# EAGLE design CC2500 Module (EAGLE 6.1)
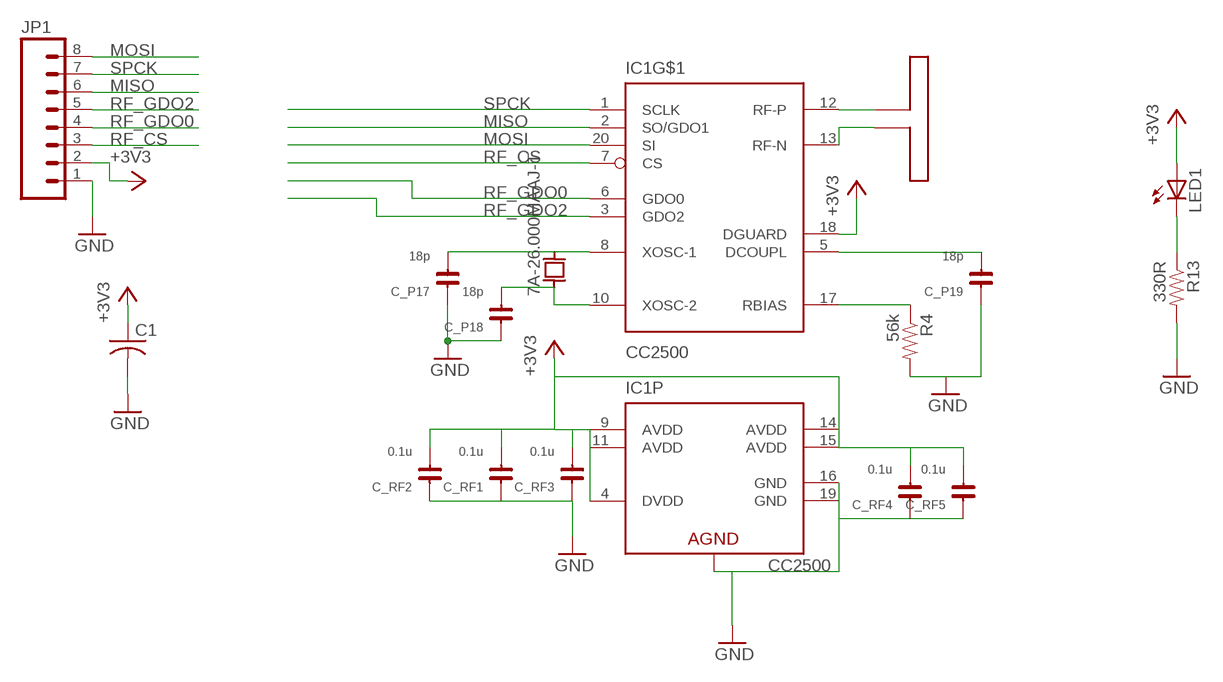
[diagram p0: schematic, sheet 1]

## Parts
C1  C-USC1206  [C1206]
C_P17  18p  CAPACITOR0603-CAP  [0603-CAP]
C_P18  18p  CAPACITOR0603-CAP  [0603-CAP]
C_P19  18p  CAPACITOR0603-CAP  [0603-CAP]
C_RF1  0.1u  CAPACITOR0603-CAP  [0603-CAP]
C_RF2  0.1u  CAPACITOR0603-CAP  [0603-CAP]
C_RF3  0.1u  CAPACITOR0603-CAP  [0603-CAP]
C_RF4  0.1u  CAPACITOR0603-CAP  [0603-CAP]
C_RF5  0.1u  CAPACITOR0603-CAP  [0603-CAP]
IC1  CC2500  [QLP-20]
JP1  M081X08  [1X08]
LED1  LED1206  [LED-1206]
R4  56k  RESISTOR0402-RES  [0402-RES]
R13  330R  RESISTOR0402-RES  [0402-RES]
U$22  ANTENNA_DIPOLE  [CC2500_FOLDED_DIPOLE_ANTENNA]
U$23  7A-26.000MAAJ-T  XTAL_2_PIN5MMX3.2MM  [5X3.2MM_SMD_XTAL]

## Nets
+3V3 [Power]: C1.1 C_RF1.2 C_RF2.2 C_RF3.2 C_RF4.2 C_RF5.2 IC1.4(P:DVDD) IC1.9(P:AVDD) IC1.11(P:AVDD) IC1.14(P:AVDD) IC1.15(P:AVDD) IC1.18(DGUARD) JP1.2 LED1.A
DCOUPL: C_P19.2 IC1.5(DCOUPL)
GND [Power]: C1.2 C_P17.1 C_P18.1 C_P19.1 C_RF1.1 C_RF2.1 C_RF3.1 C_RF4.1 C_RF5.1 IC1.16(P:GND) IC1.19(P:GND) IC1.PAD(P:AGND) IC1.THERMAL1(P:AGND) IC1.THERMAL2(P:AGND) IC1.THERMAL3(P:AGND) IC1.THERMAL4(P:AGND) IC1.THERMAL5(P:AGND) JP1.1 R4.2 R13.2
MISO: IC1.2(SO/GDO1) JP1.6
MOSI: IC1.20(SI) JP1.8
N$6: LED1.C R13.1
N$8: IC1.12(RF-P) U$22.P$1
N$13: IC1.13(RF-N) U$22.P$2
N$15: C_P17.2 IC1.8(XOSC-1) U$23.X2
N$20: C_P18.2 IC1.10(XOSC-2) U$23.X1
N$23: IC1.17(RBIAS) R4.1
RF_CS: IC1.7(CS) JP1.3
RF_GDO0: IC1.6(GDO0) JP1.4
RF_GDO2: IC1.3(GDO2) JP1.5
SPCK: IC1.1(SCLK) JP1.7

## Library data of the parts
C1 = rcl:C-US: CAPACITOR, American symbol
C_P17-C_P19 C_RF1-C_RF5 = taylor:CAPACITOR
IC1 = chipcon-ti:CC2500: Single Chip Low Cost Low Power RF Transceiver frequency band at 2400MHz-2483.5MHz.
JP1 = SparkFun:M08: Header 8 Standard 8-pin 0.1" header. Use with straight break away headers (SKU : PRT-00116), right angle break away headers (PRT-00553), swiss pins (PRT-00743), machine pins (PRT-00117), and female headers (PRT-00115).
LED1 = SparkFun:LED: LEDs Standard schematic elements and footprints for 5mm, 3mm, 1206, and 0603 sized LEDs. 5mm - Spark Fun Electronics SKU : COM-00529 (and others)
R4 R13 = SparkFun:RESISTOR: Resistor Basic schematic elements and footprints for 0603, 1206, and PTH resistors.
U$22 = taylor:ANTENNA_DIPOLE
U$23 = taylor:XTAL_2_PIN: 5mm x 3.2mm smd crystal 16MHz and other 8pF load caps 644-1037-1-ND NX5032GA-16.000000MHZ 6mmx3.5mm 18.432MHz and 20MHz crystals 20pF load XC826CT-ND XC830CT-ND ABS06 RTC 535-10104-1-ND 18pf

## Net classes
0 default: width 0.254 mm, drill 0.508 mm, clearance 0.254 mm
1 Power: width 0.762 mm, drill 0.889 mm, clearance 0.203 mm

## Board
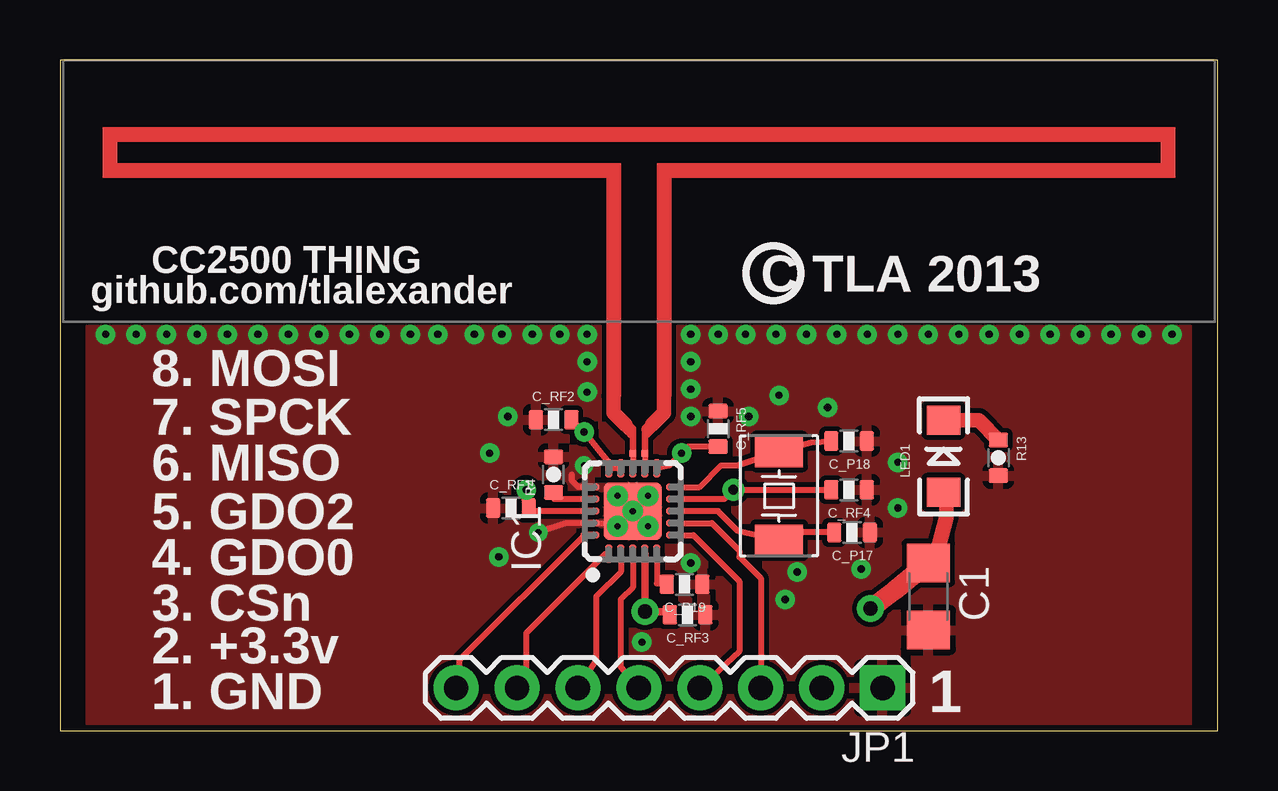
[diagram p1: board, top side]
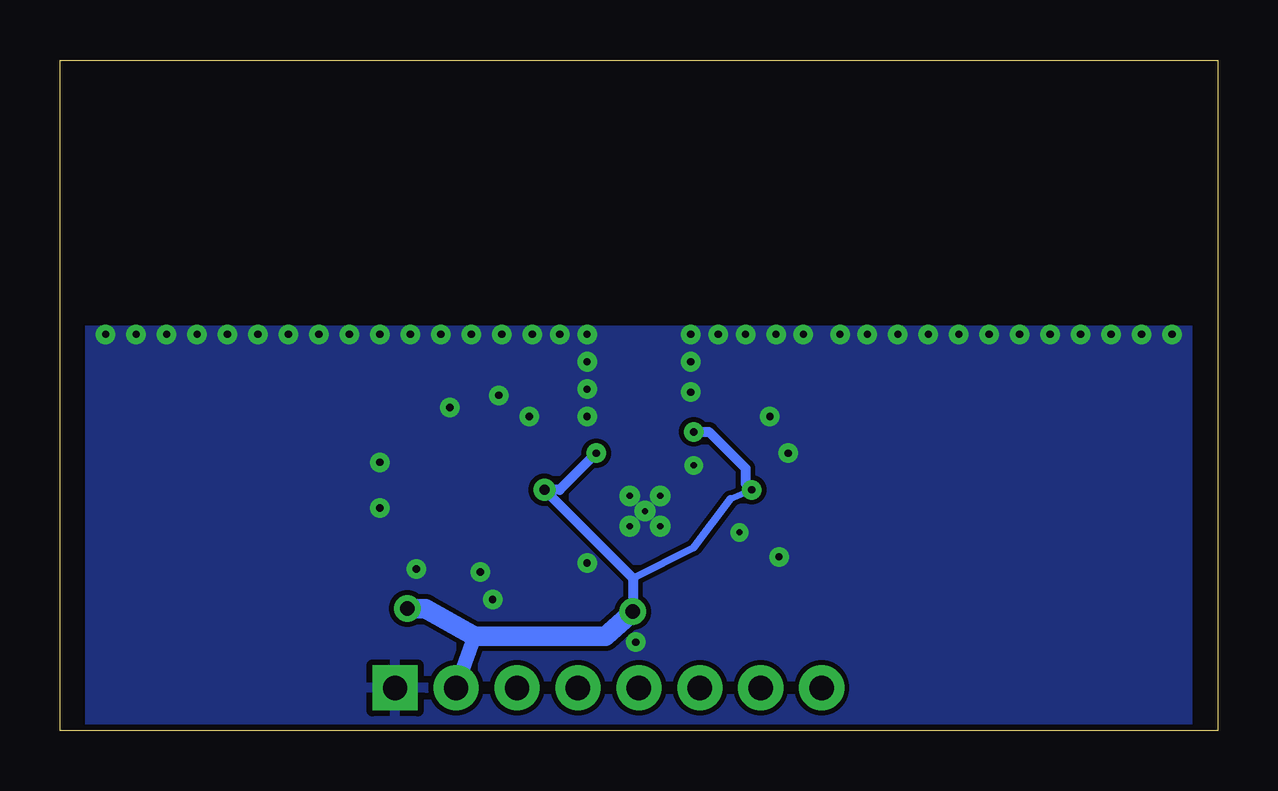
[diagram p2: board, bottom side, seen from below]

Size 48.26 x 27.94 mm. Coordinates in mm from the lower left corner, seen from the top.
Outline: 0,0 48.26,0 48.26,27.94 0,27.94 0,0
Copper layers (1*16): Top 0.035mm / dielectric 1.5mm / Bottom 0.035mm
Design rules "default": minimum track width 8mil, minimum drill 20mil, track to track 8mil, track to pad 8mil, pad to pad 8mil, via to via 8mil, smd to smd 8mil, copper to edge 10mil, drill to drill 8mil, minimum pad ring 12mil, minimum via ring 10mil, stop-mask expansion 4mil, vias tented up to drill 25mil, thermal gap 10mil
tRestrict: area 0,17 to 48.3,27.9
bRestrict: area 0,17 to 48.3,27.9

### Footprints (pad centres in the part's own frame; a part is rotated, then mirrored left to right if it is on the bottom)
C1206 = smd 1.6 x 1.8: 1 -1.4,0; 2 1.4,0
0603-CAP = smd 0.6 x 0.8: 1 -0.74,0; 2 0.74,0
QLP-20 = smd 0.76 x 0.28: 1 -1.78,1; 2 -1.78,0.5; 3 -1.78,0; 4 -1.78,-0.5; 5 -1.78,-1; 11 1.78,-1; 12 1.78,-0.5; 13 1.78,0; 14 1.78,0.5; 15 1.78,1 | smd 0.28 x 0.76: 6 -1,-1.78; 7 -0.5,-1.78; 8 0,-1.78; 9 0.5,-1.78; 10 1,-1.78; 16 1,1.78; 17 0.5,1.78; 18 0,1.78; 19 -0.5,1.78; 20 -1,1.78 | smd 2.4 x 2.4: PAD 0,0 | drill 0.254: THERMAL1 0,0; THERMAL2 -0.635,0.635; THERMAL3 0.635,0.635; THERMAL4 0.635,-0.635; THERMAL5 -0.635,-0.635
1X08 = drill 1.016 pad 1.88 square: 1 0,0 | drill 1.016 pad 1.88: 2 2.54,0; 3 5.08,0; 4 7.62,0; 5 10.16,0; 6 12.7,0; 7 15.24,0; 8 17.78,0
LED-1206 = smd 1.2 x 1.4: A -1.5,0; C 1.5,0
0402-RES = smd 0.6 x 0.8: 1 -0.74,0; 2 0.74,0
CC2500_FOLDED_DIPOLE_ANTENNA = smd 0.28 x 0.28: P$1 0.25,-16.4; P$2 -0.25,-16.4
5X3.2MM_SMD_XTAL = smd 1.3 x 2: X1 -1.85,0; X2 1.85,0

### Placement (x,y rotation side)
C1  36.2,5.59 270 top
C_P17  33.02,8.26 180 top
C_P18  32.89,12.06 180 top
C_P19  26.04,6.1 180 top
C_RF1  18.8,9.27 0 top
C_RF2  20.57,12.95 0 top
C_RF3  26.16,4.83 180 top
C_RF4  32.89,10.03 180 top
C_RF5  27.43,12.57 270 top
IC1  23.88,9.14 90 top
JP1  34.29,1.78 180 top
LED1  36.83,11.43 90 top
R4  20.57,10.67 90 top
R13  39.12,11.37 270 top
U$22  24.13,27.94 0 top
U$23  29.97,9.78 270 top

### Tracks (layer width: path | path; a pad name or v marks a point on that pad's centre or on a via)
+3V3  (via drill 0.3, 0.41, 0.6)
  Top 0.254: IC1.14 IC1.15 22.88,11.16 v21.84,12.45 21.84,12.42 C_RF2.2 | IC1.11 25.39,11.04 v25.91,11.56 26.18,11.83 C_RF5.2 | IC1.9 27.68,9.64 v28.07,10.03 C_RF4.2 | v19.43,10.03 C_RF1.2 19.66,9.14 IC1.18
  Top 0.305: IC1.4 v24.38,4.95 25.3,4.95 C_RF3.2
  Top 0.61: C1.1 36.45,6.99 36.96,8.89 36.96,9.93 LED1.A
  Top 0.813: C1.1 34.8,5.84 v33.78,5.08
  Bottom 0.254: 20.32,9.65 v19.43,10.03
  Bottom 0.305: 20.32,9.65 21.84,7.62 24.38,6.35
  Bottom 0.406: v24.38,4.95 24.38,6.35 v28.07,10.03 27.43,10.03 v25.91,11.56 | v21.84,12.45 21.21,12.45 19.68,10.92 19.68,10.29 v19.43,10.03
  Bottom 0.61: JP1.2 30.99,3.94
  Bottom 0.813: v24.38,4.95 25.53,3.94 30.99,3.94 33.02,5.08 v33.78,5.08
DCOUPL
  Top 0.254: IC1.5 24.88,6.13 C_P19.2
GND  (via drill 0.25, 0.3)
  Top 0.254: 21.59,10.16 21.61,10.14 IC1.16 21.96,10.16 21.59,10.16 | 21.59,10.16 21.34,10.41 21.34,10.67 | v19.94,8.26 21.09,8.64 IC1.19 23.24,8.64 IC1.THERMAL2
  other vias: 17.91,11.56 20.83,16.51 27.43,16.51 31.11,16.51 29.84,16.51 28.57,16.51 19.68,16.51 18.41,16.51 17.27,16.51 15.75,16.51 14.61,16.51 13.34,16.51 12.06,16.51 10.79,16.51 9.53,16.51 8.26,16.51 32.38,16.51 33.66,16.51 34.92,16.51 36.2,16.51 37.47,16.51 38.73,16.51 40.01,16.51 41.27,16.51 42.55,16.51 43.81,16.51 45.09,16.51 46.35,16.51 6.99,16.51 4.45,16.51 3.17,16.51 1.91,16.51 26.29,16.51 30.23,5.46 30.73,6.6 26.29,6.99 24.26,3.68 18.29,7.24 32,13.46 33.4,6.73 18.67,13.08 29.97,13.97 26.29,13.08 21.97,14.1 28.7,13.08 26.29,14.22 26.29,15.37 21.97,15.37 21.97,16.51 5.71,16.51 21.84,11.05 34.92,11.18 34.92,9.27
  pour Top (rank 2): 1.27,0 46.99,0 46.99,27.94 1.27,27.94
  pour Bottom: 1.27,0 46.99,0 46.99,27.94 1.27,27.94
MISO
  Top 0.254: IC1.2 23.38,6.61 22.35,5.59 22.35,2.92 JP1.6
MOSI
  Top 0.254: IC1.20 21.86,8.14 16.64,2.92 16.64,2.16 JP1.8
N$6
  Top 0.61: R13.1 38.29,12.93 LED1.C
N$8
  Top 0.254: U$22.P$1 IC1.12
N$13
  Top 0.254: U$22.P$2 IC1.13
N$15
  Top 0.254: C_P17.2 30.48,8.26 arc4 29.21,8.38 U$23.X2 28.27,8.31 27.43,9.14 IC1.8
N$20
  Top 0.254: IC1.10 26.65,10.14 27.56,11.05 28.25,11.05 U$23.X1 31.32,12.01 C_P18.2
N$23
  Top 0.254: IC1.17 20.6,9.64 R4.1
RF_CS
  Top 0.254: IC1.7 27.17,8.64 28.32,7.49 28.32,7.24 29.21,6.35 JP1.3
RF_GDO0
  Top 0.254: IC1.6 26.4,8.14 28.32,6.22 28.32,3.3 JP1.4
RF_GDO2
  Top 0.254: IC1.3 23.88,5.97 23.37,5.46 23.37,2.67 JP1.5
SPCK
  Top 0.254: IC1.1 22.73,7.36 19.43,4.06 19.43,2.29 JP1.7

### Text on the board
tPlace: CC2500 THING | github.com/tlalexander | C TLA 2013 | 8. MOSI | 7. SPCK | 6. MISO | 5. GDO2 | 4. GDO0 | 3. CSn | 2. +3.3v | 1. GND | 1